# Altium schematic sheet ANALOG_PART.SchDoc
size A3; SheetNumber: 1; SheetTotal: 2
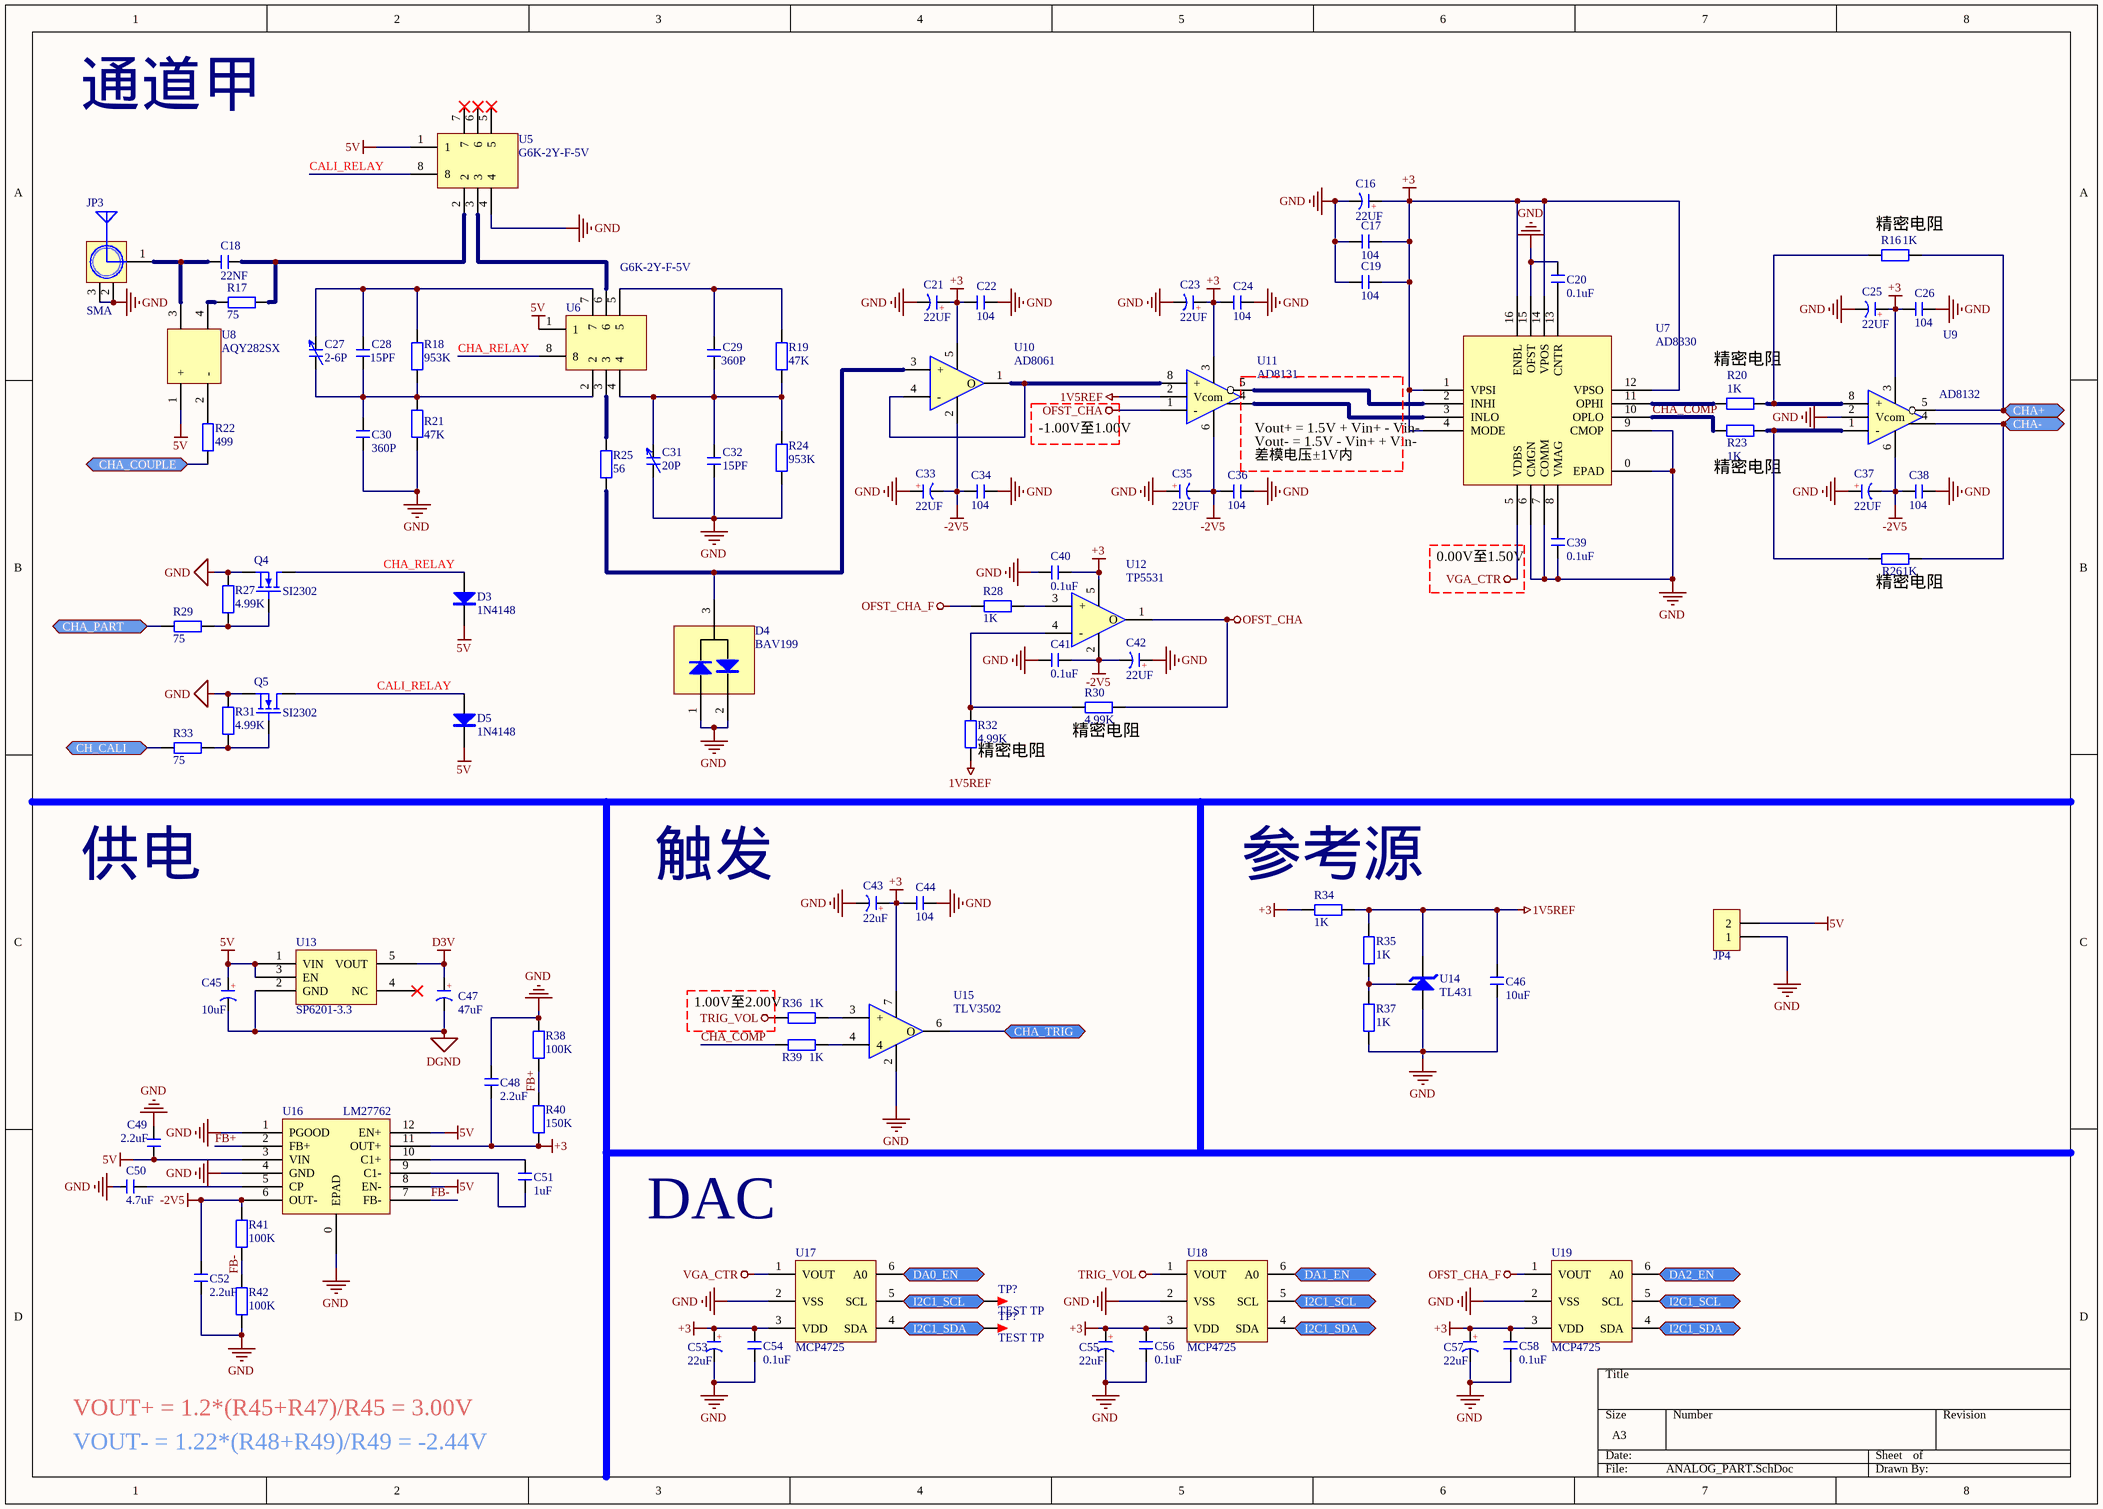
[diagram p0: ANALOG_PART.SchDoc]

## Parts
(Parts that share a designator on the sheet are numbered #1, #2 ... from top to bottom, then left to right.)
C16  22UF  [C 0603_L]
C17  104  [C 0603_L]
C18  22NF  [C 1206_L]
C19  104  [C 0603_L]
C20  0.1uF  [C 0603_L]
C21  22UF  [C 0603_L]
C22  104  [C 0603_L]
C23  22UF  [C 0603_L]
C24  104  [C 0603_L]
C25  22UF  [C 0603_L]
C26  104  [C 0603_L]
C27  2-6P  [RC-SMD]
C28  15PF  [C 0603_L]
C29  360P  [C 0603_L]
C30  360P  [C 0603_L]
C31  20P  [RC-SMD]
C32  15PF  [C 0603_L]
C33  22UF  [C 0603_L]
C34  104  [C 0603_L]
C35  22UF  [C 0603_L]
C36  104  [C 0603_L]
C37  22UF  [C 0603_L]
C38  104  [C 0603_L]
C39  0.1uF  [C 0603_L]
C40  0.1uF  [C 0603_L]
C41  0.1uF  [C 0603_L]
C42  22UF  [C 0603_L]
C43  22uF  [C 0603_L]
C44  104  [C 0603_L]
C45  10uF  [C 0603_L]
C46  10uF  [C 1206_L]
C47  47uF  [C 0603_L]
C48  2.2uF  [C 0603_L]
C49  2.2uF  [C 0603_L]
C50  4.7uF  [C 0603_L]
C51  1uF  [C 0603_L]
C52  2.2uF  [C 0603_L]
C53  22uF  [C 0603_L]
C54  0.1uF  [C 0603_L]
C55  22uF  [C 0603_L]
C56  0.1uF  [C 0603_L]
C57  22uF  [C 0603_L]
C58  0.1uF  [C 0603_L]
D3  1N4148  [SOD-323]
D4  BAV199  [SOT23-3L]
D5  1N4148  [SOD-323]
JP3  SMA  [SMA-KE-LI]
JP4  HDR-1X2  [XH2.54-WI-2P]  (value not drawn)
Q4  SI2302  [SOT23-3L]
Q5  SI2302  [SOT23-3L]
R16  1K  [R 0603_L]
R17  75  [R 0603_L]
R18  953K  [R 0603_L]
R19  47K  [R 0603_L]
R20  1K  [R 0603_L]
R21  47K  [R 0603_L]
R22  499  [R 0603_L]
R23  1K  [R 0603_L]
R24  953K  [R 0603_L]
R25  56  [R 0603_L]
R26  1K  [R 0603_L]
R27  4.99K  [R 0603_L]
R28  1K  [R 0603_L]
R29  75  [R 0603_L]
R30  4.99K  [R 0603_L]
R31  4.99K  [R 0603_L]
R32  4.99K  [R 0603_L]
R33  75  [R 0603_L]
R34  1K  [R 0603_L]
R35  1K  [R 0603_L]
R36  1K  [R 0603_L]
R37  1K  [R 0603_L]
R38  100K  [R 0603_L]
R39  1K  [R 0603_L]
R40  150K  [R 0603_L]
R41  100K  [R 0603_L]
R42  100K  [R 0603_L]
TP?#1  TEST TP  [TEST TP1.4_B]
TP?#2  TEST TP  [TEST TP1.4_B]
U5  G6K-2Y-F-5V  [G6K-2F-Y]
U6  G6K-2Y-F-5V  [G6K-2F-Y]
U7  AD8330  [LFCSP-16]
U8  AQY282SX  [SOP4_L]
U9  AD8132  [SOP8_L]
U10  AD8061  [SOT23-5]
U11  AD8131  [SOP8_L]
U12  TP5531  [SOT23-5]
U13  SP6201-3.3  [SOT23-5L]
U14  TL431  [SOT23-3L]
U15  TLV3502  [SOIC-8]
U16  LM27762  [WSON-12]
U17  MCP4725  [SOT23-6L]
U18  MCP4725  [SOT23-6L]
U19  MCP4725  [SOT23-6L]

## Ports
CH_CALI (bidir), CHA+ (bidir), CHA- (bidir), CHA_COUPLE (bidir), CHA_PART (bidir), CHA_TRIG (bidir), DA0_EN (bidir), DA1_EN (bidir), DA2_EN (bidir), I2C1_SCL (bidir), I2C1_SDA (bidir)

## Nets
1V5REF: C46.1 R32.2 R34.2 R35.2 U11.2(Vcom) U14.1
5V: C45.1(A) C49.2 D3.2(K) D5.2(K) JP4.2 U5.1 U6.1 U8.1(+) U13.1(VIN) U13.3(EN) U16.3(VIN) U16.8(EN-) U16.12(EN+)
+3: C16.1(A) C17.1 C19.1 C21.1(A) C22.2 C23.1(A) C24.2 C25.1(A) C26.2 C40.1 C43.1(A) C44.2 C48.1 C53.1(A) C54.1 C55.1(A) C56.1 C57.1(A) C58.1 R34.1 R40.1 U7.1(VPSI) U7.4(MODE) U7.12(VPSO) U7.14(VPOS) U7.16(ENBL) U9.3 U10.5 U11.3 U12.5 U15.7 U16.11(OUT+) U17.3(VDD) U18.3(VDD) U19.3(VDD)
-2V5: C33.2(K) C34.2 C35.2(K) C36.2 C37.2(K) C38.2 C41.1 C42.2(K) C52.1 R41.1 U9.6 U10.2 U11.6 U12.2 U16.6(OUT-)
D3V: C47.1(A) U13.5(VOUT)
DGND: C45.2(K) C47.2(K) U13.2(GND)
GND: C16.2(K) C17.2 C19.2 C20.1 C21.2(K) C22.1 C23.2(K) C24.1 C25.2(K) C26.1 C30.1 C31.1 C32.1 C33.1(A) C34.1 C35.1(A) C36.1 C37.1(A) C38.1 C39.2 C40.2 C41.2 C42.1(A) C43.2(K) C44.1 C46.2 C48.2 C49.1 C50.1 C52.2 C53.2(K) C54.2 C55.2(K) C56.2 C57.2(K) C58.2 D4.1 D4.2 JP3.2(GND) JP3.3(GND) JP4.1 Q4.2 Q5.2 R21.1 R24.1 R27.2 R31.2 R37.1 R38.2 R42.2 U5.4 U7.0(EPAD) U7.6(CMGN) U7.7(COMM) U7.9(CMOP) U7.15(OFST) U9.2(Vcom) U14.3 U15.2(-) U16.0(EPAD) U16.1(PGOOD) U16.4(GND) U17.2(VSS) U18.2(VSS) U19.2(VSS)
OFST_CHA: R30.2 U11.1(-) U12.1(O)
OFST_CHA_F: R28.2 U19.1(VOUT)
TRIG_VOL: R36.1 U18.1(VOUT)
VGA_CTR: U7.5(VDBS) U17.1(VOUT)
CALI_RELAY: D5.1(A) Q5.3 U5.8
CH_CALI: R33.2 ; port CH_CALI
CHA+: R16.2 U9.5 ; port CHA+
CHA-: R26.2 U9.4 ; port CHA-
CHA_COMP: R23.1 R39.1 U7.10(OPLO)
CHA_COUPLE: R22.1 ; port CHA_COUPLE
CHA_PART: R29.2 ; port CHA_PART
CHA_RELAY: D3.1(A) Q4.3 U6.8
CHA_TRIG: U15.6(O) ; port CHA_TRIG
DA0_EN: U17.6(A0) ; port DA0_EN
DA1_EN: U18.6(A0) ; port DA1_EN
DA2_EN: U19.6(A0) ; port DA2_EN
FB+: R38.1 R40.2 U16.2(FB+)
FB-: R41.2 R42.1 U16.7(FB-)
I2C1_SCL: TP?#1.1 U17.5(SCL) U18.5(SCL) U19.5(SCL) ; port I2C1_SCL
I2C1_SDA: TP?#2.1 U17.4(SDA) U18.4(SDA) U19.4(SDA) ; port I2C1_SDA
NetC18_1: C18.1 JP3.1(ANT) U8.3
NetC18_2: C18.2 R17.2 U5.2
NetC20_2: C20.2 U7.13(CNTR)
NetC27_1: C27.1 C28.1 C30.2 R18.1 R21.2 U6.2
NetC27_2: C27.2 C28.2 R18.2 U6.7
NetC29_1: C29.1 C31.2 C32.2 R19.1 R24.2 U6.4
NetC29_2: C29.2 R19.2 U6.5
NetC39_1: C39.1 U7.8(VMAG)
NetC50_2: C50.2 U16.5(CP)
NetC51_1: C51.1 U16.10(C1+)
NetC51_2: C51.2 U16.9(C1-)
NetD4_3: D4.3 R25.1 U10.3(+)
NetQ4_1: Q4.1 R27.1 R29.1
NetQ5_1: Q5.1 R31.1 R33.1
NetR16_1: R16.1 R20.2 U9.8(+)
NetR17_1: R17.1 U8.4
NetR20_1: R20.1 U7.11(OPHI)
NetR22_2: R22.2 U8.2(-)
NetR23_2: R23.2 R26.1 U9.1(-)
NetR25_2: R25.2 U6.3
NetR28_1: R28.1 U12.3(+)
NetR30_1: R30.1 R32.1 U12.4(-)
NetR35_1: R35.1 R37.2 U14.2
NetR36_2: R36.2 U15.3(+)
NetR39_2: R39.2 U15.4
NetU5_3: U5.3 U6.6
NetU7_2: U7.2(INHI) U11.5
NetU7_3: U7.3(INLO) U11.4
NetU10_1: U10.1(O) U10.4(-) U11.8(+)

Not connected (* = marked no-connect by the designer): U5 5* 6* 7*; U13 4(NC)*

## Notes on the sheet
- 通道甲
- (near R16) 精密电阻
- (near R20) 精密电阻
- -1.00V至1.00V
- Vout+ = 1.5V + Vin+ - Vin-
- (near U7) Vout- = 1.5V - Vin+ + Vin-
- 差模电压±1V内
- (near R23) 精密电阻
- 0.00V至1.50V
- (near R26) 精密电阻
- (near R32) 精密电阻
- (near R30) 精密电阻
- 供电
- 触发
- (near R34) 参考源
- (near R36) 1.00V至2.00V
- DAC
- VOUT- = 1.22*(R48+R49)/R49 = -2.44V
- VOUT+ = 1.2*(R45+R47)/R45 = 3.00V
- (in symbol C-CD) +

## Library data of the parts
C16 C21 C23 C25 C33 C35 C37 C42 C43 C45 C47 C53 C55 C57 = C-CD: 贴片钽电容; 版权归属: 源创客; BOM名称: 贴片钽电容; 学习资源: www.ooocke.com
C17-C20 C22 C24 C26 C28-C30 C32 C34 C36 C38-C41 C44 C46 C48-C52 C54 C56 C58 = C: 无极性贴片电容; 版权归属: 源创客; BOM名称: 无极性贴片电容; 学习资源: www.ooocke.com
C27 C31 = CP_SMD: 贴片可调电容
D3 D5 = 1N4148: 高速开关二极管; 版权归属: 源创客; BOM名称: 高速开关二极管; 学习资源: www.ooocke.com
D4 = BAV199: 双肖特基二极管; BOM名称: 肖特基二极管; 版权归属: 源创客; 属性: 40V/2A; 学习资源: www.ooocke.com
JP3 = SMA: SMA-2.4G射频天线接口; 版权归属: 源创客; BOM名称: SMA-2.4G射频天线接口; 学习资源: www.ooocke.com
JP4 = Header 2: 2P接插件; 版权归属: 源创客; BOM名称: 2P接插件; 学习资源: www.ooocke.com
Q4 Q5 = SI2302: 场效应管
R16-R42 = R: 贴片电阻; 版权归属: 源创客; BOM名称: 贴片电阻; 学习资源: www.ooocke.com
TP?#1 TP?#2 = TEST TP: 测试环; 版权归属: 源创客; BOM名称: 测试环; 学习资源: www.ooocke.com
U5 U6 = G6K-2Y-F-5V: 继电器
U7 = AD8330: 压控放大器
U8 = AQY282SX: 光电固态继电器
U9 = AD8132: 全差分运放; BOM名称: 单路精密运放; 版权归属: 源创客; 学习资源: www.ooocke.com
U10 = AD8061: FET输入运放; BOM名称: 单路精密运放; 版权归属: 源创客; 学习资源: www.ooocke.com
U11 = AD8131: 全差分运放; BOM名称: 单路精密运放; 版权归属: 源创客; 学习资源: www.ooocke.com
U12 = TP5531: 零漂运放; BOM名称: 单路精密运放; 版权归属: 源创客; 学习资源: www.ooocke.com
U13 = SP6201-3.3: 线性稳压器
U14 = TL431: 电压基准芯片
U15 = TLV3502: 高速比较器; BOM名称: 单路精密运放; 版权归属: 源创客; 学习资源: www.ooocke.com
U16 = LM27762: DC-DC电源芯片
U17-U19 = MCP4725: 单通道DAC